# EAGLE design tweeq-Proto_Motor (EAGLE 6.4)
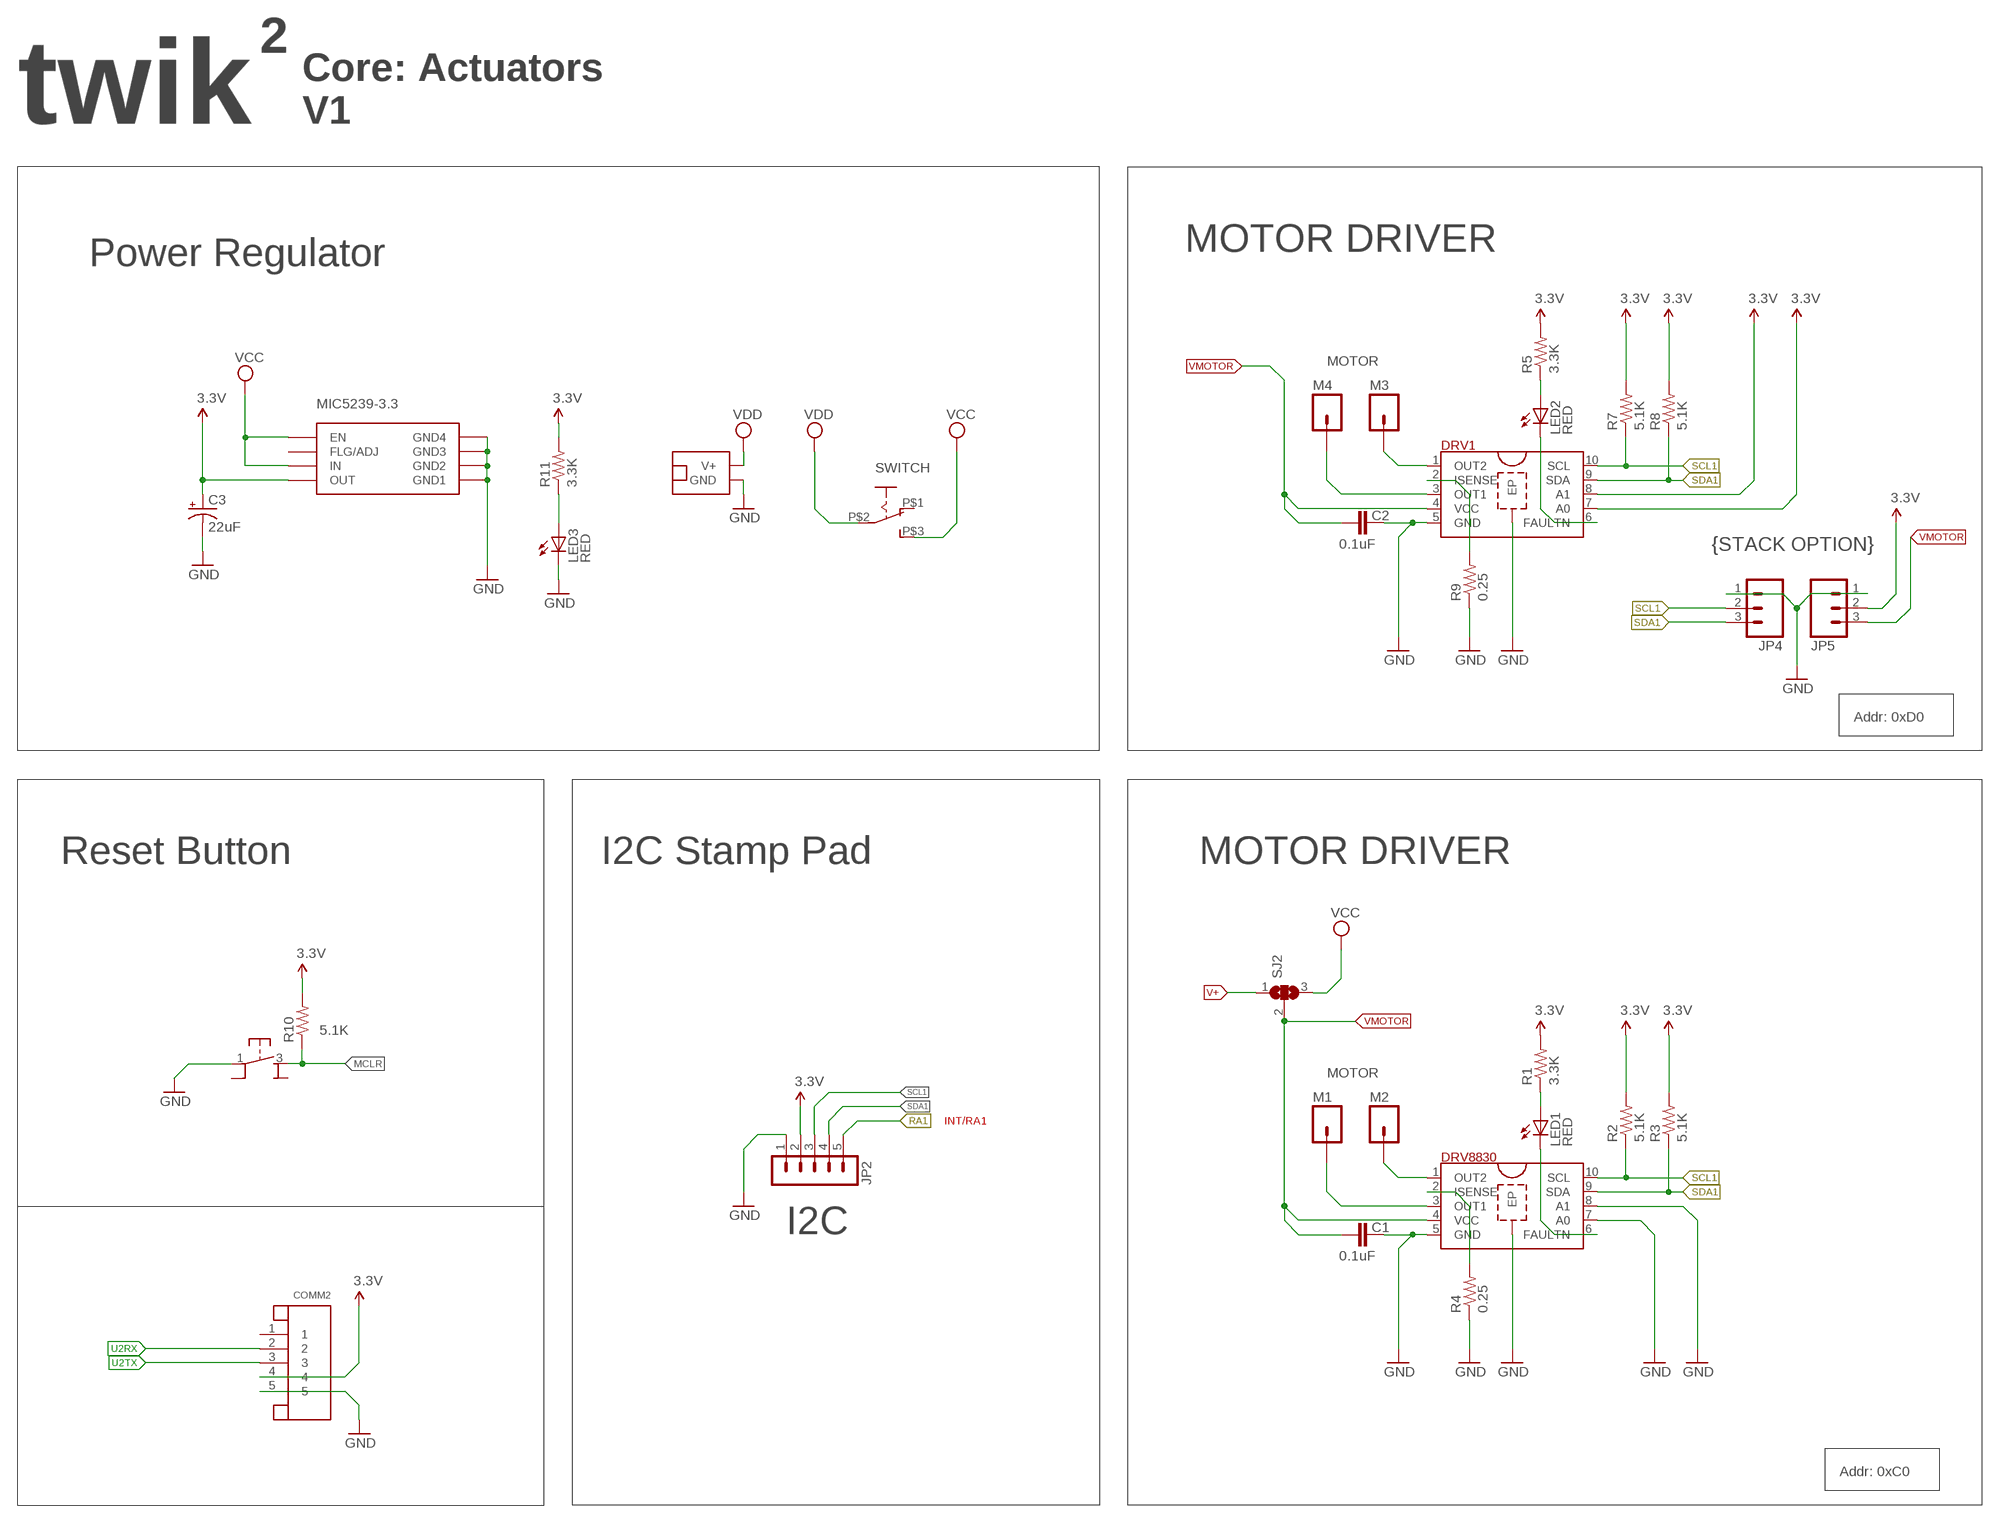
[diagram p0: schematic, sheet 1, part 1 of 2]
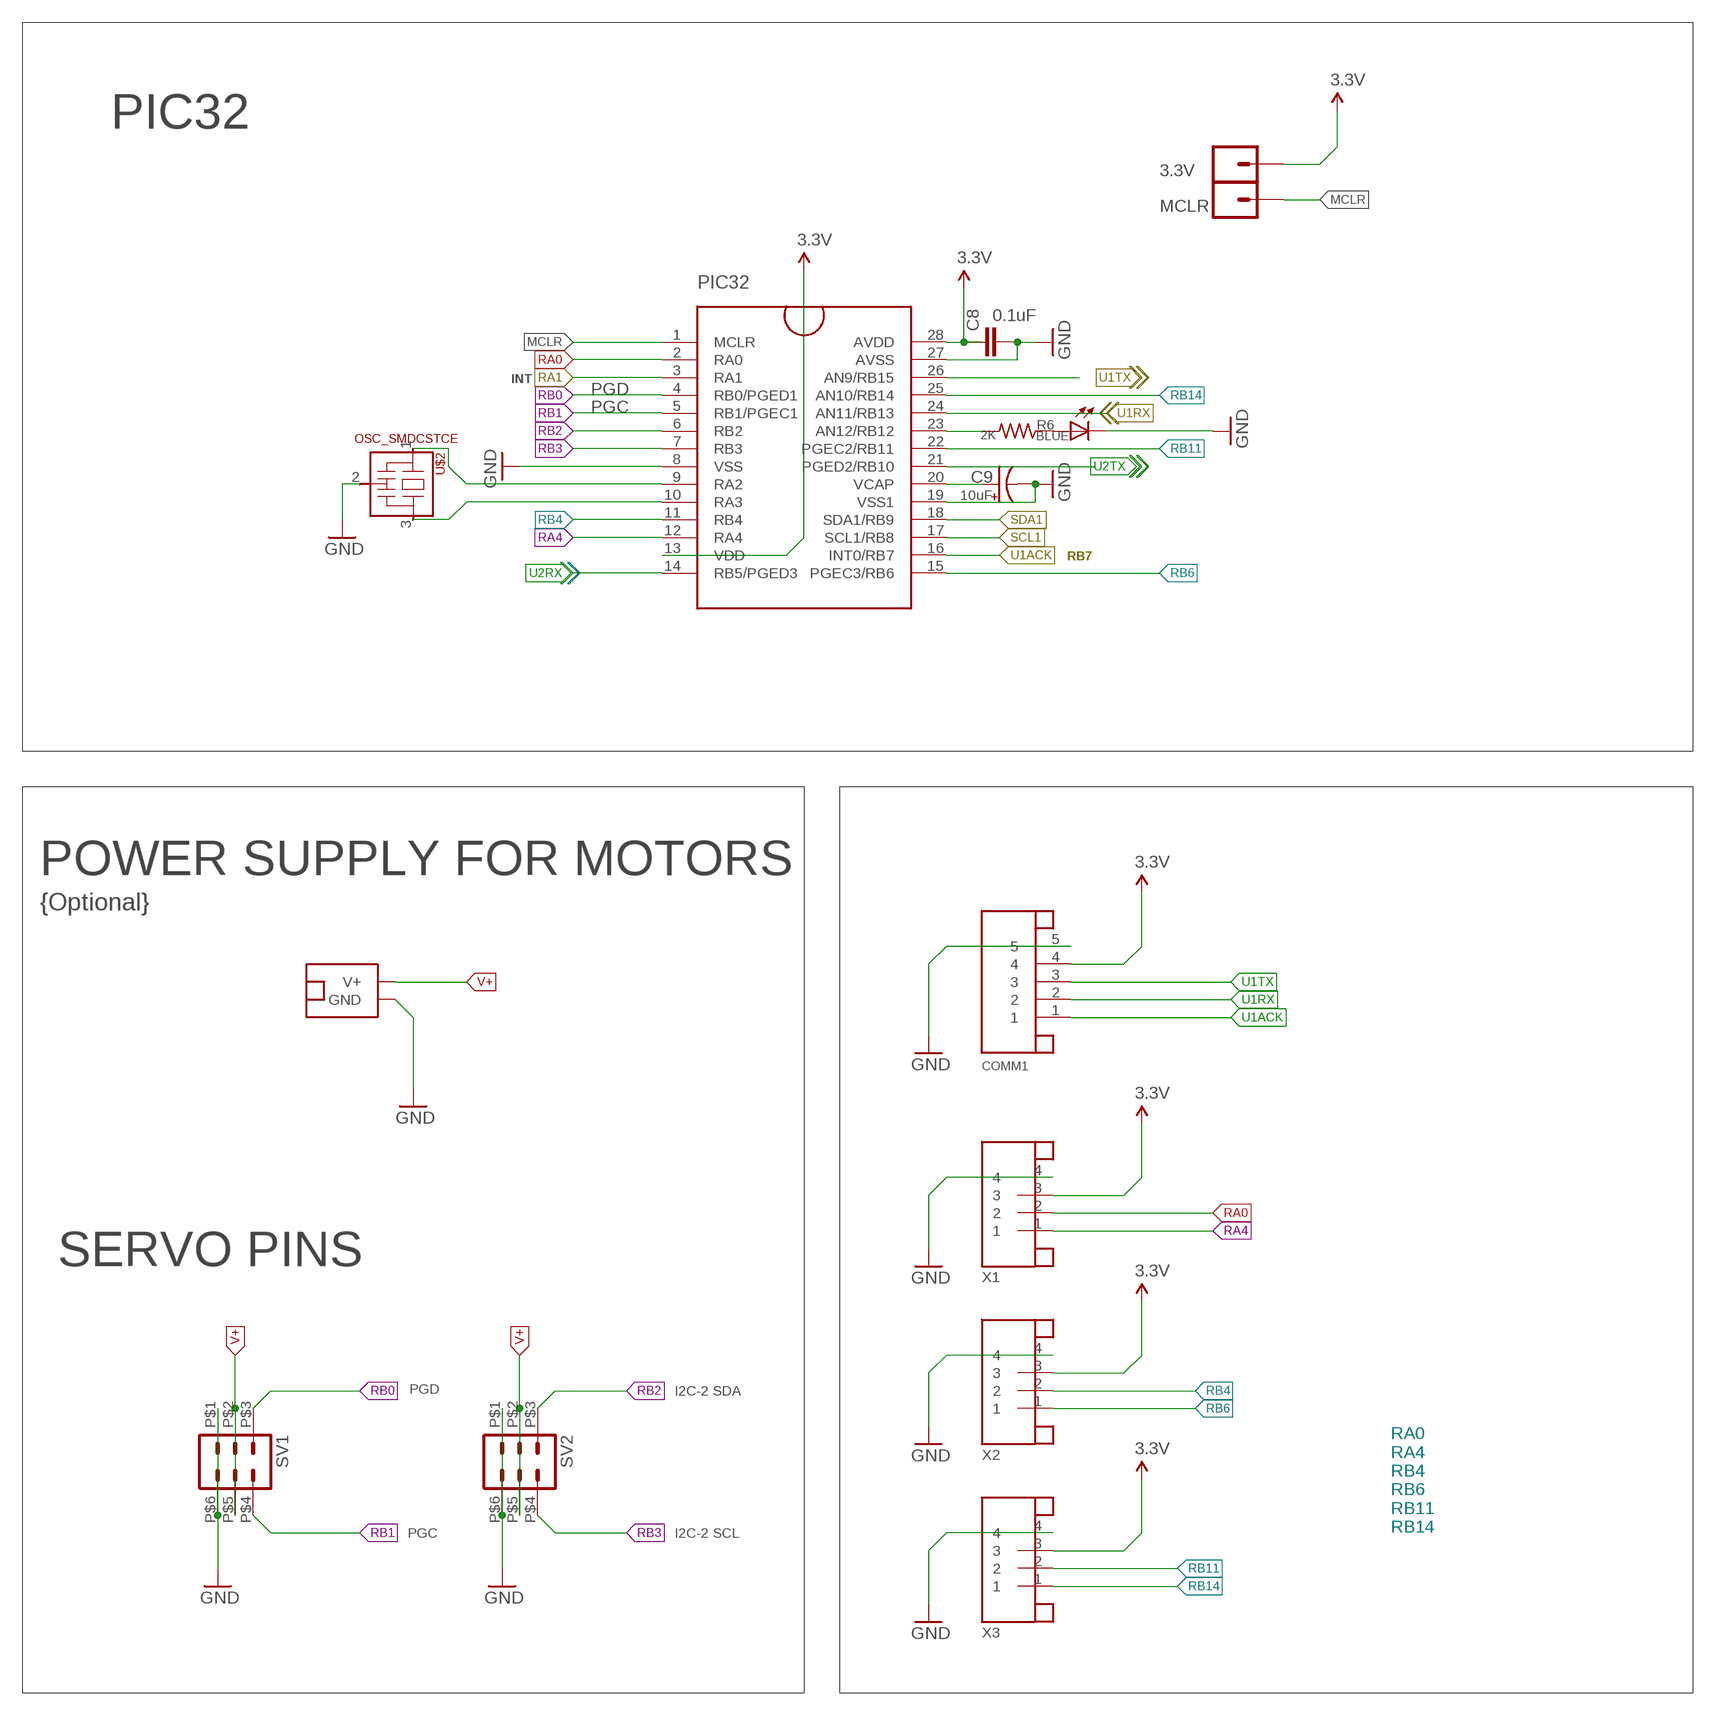
[diagram p1: schematic, sheet 1, part 2 of 2]

## Parts
3.3V  M01  [AISCUBE_1X01_TIGHTFITVIA]
C1  0.1uF  C-EUC0402K  [C0402K]
C2  0.1uF  C-EUC0402K  [C0402K]
C3  22uF  CPOL-USSMCB  [SMC_B]
C8  0.1uF  C-EUC0402K  [C0402K]
C9  10uF  CPOL-USA/3216-18R  [A/3216-18R]
COMM1  JST-5PINSH  [SH1.0-5PIN]
COMM2  JST-5PINSH  [SH1.0-5PIN]
DRV1  DRV8830DGQ  [MSOP10_POWERPAD]
DRV8830  DRV8830DGQ  [MSOP10_POWERPAD]
JP2  M05-11.5MM-SMT  [1X05-1.5MM-SMT]
JP4  M03/NS  [1X03_NS]
JP5  M03/NS  [1X03_NS]
LED1  RED  LEDCHIPLED_0805  [CHIPLED_0805]
LED2  RED  LEDCHIPLED_0805  [CHIPLED_0805]
LED3  RED  LEDCHIP-LED0805  [CHIP-LED0805]
M1  M01SQ_NS  [1X01_SQ]
M2  M01SQ_NS  [1X01_SQ]
M3  M01SQ_NS  [1X01_SQ]
M4  M01SQ_NS  [1X01_SQ]
MCLR  M01  [AISCUBE_1X01_TIGHTFITVIA]
MIC5239-3.3  MIC5239-MM  [MSOP8]
PIC32  PIC32MX_1XX_2XX  [SSOP28]
PIC_LED  BLUE  LEDCHIP-LED0805  [CHIP-LED0805]
R1  3.3K  R-US_R0402  [R0402]
R2  5.1K  R-US_R0402  [R0402]
R3  5.1K  R-US_R0402  [R0402]
R4  0.25  R-US_R0402  [R0402]
R5  3.3K  R-US_R0402  [R0402]
R6  2K  R-US_R0402  [R0402]
R7  5.1K  R-US_R0402  [R0402]
R8  5.1K  R-US_R0402  [R0402]
R9  0.25  R-US_R0402  [R0402]
R10  5.1K  R-US_R0402  [R0402]
R11  3.3K  R-US_R0402  [R0402]
SJ2  JUMPER_SJ2W  [JUMPER_SJ_2]
SV1  M03-2EDGE_PAD  [2X03_EDGEPAD]
SV2  M03-2EDGE_PAD  [2X03_EDGEPAD]
SWITCH  SLIDE_SWITCH_SMALL  [SLIDE_SWITCH_SMALL]
U$2  OSC_SMDCSTCE  [CSTCE_RESONATOR_SMD]
U$4  PB_MICRO_SMT  [PB_SMT_3.5X3X2]
U$9  POWER_CONN/PTH  [POWER_CONN_PTH]
U$10  POWER_CONN/PTH  [POWER_CONN_PTH]
X1  JST-4PINSH  [SH1.0-4PIN]
X2  JST-4PINSH  [SH1.0-4PIN]
X3  JST-4PINSH  [SH1.0-4PIN]

## Nets
3.3V: 3.3V.P$1 C3.+ C8.1 COMM1.4 COMM2.4 DRV1.7(A0) DRV1.8(A1) JP2.2 JP5.2 MIC5239-3.3.4(OUT) PIC32.13(VDD) PIC32.28(AVDD) R1.2 R2.2 R3.2 R5.2 R7.2 R8.2 R10.2 R11.2 X1.3 X2.3 X3.3
GND: C1.2 C2.2 C3.- C8.2 C9.- COMM1.5 COMM2.5 DRV1.5(GND) DRV1.EP DRV8830.5(GND) DRV8830.7(A0) DRV8830.8(A1) DRV8830.EP JP2.1 JP4.1 JP5.1 LED3.C MIC5239-3.3.5(GND1) MIC5239-3.3.6(GND2) MIC5239-3.3.7(GND3) MIC5239-3.3.8(GND4) PIC32.8(VSS) PIC32.19(VSS1) PIC32.27(AVSS) PIC_LED.C R4.1 R9.1 SV1.P$1 SV1.P$6 SV2.P$1 SV2.P$6 U$2.2(VSS) U$4.1 U$9.GND U$10.GND X1.4 X2.4 X3.4
LED: PIC32.23(AN12/RB12) R6.2
MCLR: MCLR.P$1 PIC32.1(MCLR) R10.1 U$4.3
N$2: PIC32.9(RA2) U$2.1
N$3: PIC_LED.A R6.1
N$4: C9.+ PIC32.20(VCAP)
N$6: PIC32.10(RA3) U$2.3
N$8: DRV8830.6(FAULTN) LED1.C
N$9: LED1.A R1.1
N$10: DRV8830.1(OUT2) M2.1
N$11: DRV8830.3(OUT1) M1.1
N$12: DRV8830.2(ISENSE) R4.2
N$15: DRV1.6(FAULTN) LED2.C
N$16: LED2.A R5.1
N$17: DRV1.1(OUT2) M3.1
N$18: DRV1.3(OUT1) M4.1
N$19: DRV1.2(ISENSE) R9.2
N$20: LED3.A R11.1
RA0: PIC32.2(RA0) X1.2
RA1: JP2.5 PIC32.3(RA1)
RA4: PIC32.12(RA4) X1.1
RB0: PIC32.4(RB0/PGED1) SV1.P$3
RB1: PIC32.5(RB1/PGEC1) SV1.P$4
RB2: PIC32.6(RB2) SV2.P$3
RB3: PIC32.7(RB3) SV2.P$4
RB4: PIC32.11(RB4) X2.2
RB6: PIC32.15(PGEC3/RB6) X2.1
RB11: PIC32.22(PGEC2/RB11) X3.2
RB14: PIC32.25(AN10/RB14) X3.1
SCL1: DRV1.10(SCL) DRV8830.10(SCL) JP2.3 JP4.2 PIC32.17(SCL1/RB8) R2.1 R7.1
SDA1: DRV1.9(SDA) DRV8830.9(SDA) JP2.4 JP4.3 PIC32.18(SDA1/RB9) R3.1 R8.1
U1ACK: COMM1.1 PIC32.16(INT0/RB7)
U1RX: COMM1.2 PIC32.24(AN11/RB13)
U1TX: COMM1.3 PIC32.26(AN9/RB15)
U2RX: COMM2.2 PIC32.14(RB5/PGED3)
U2TX: COMM2.3 PIC32.21(PGED2/RB10)
V+: SJ2.1 SV1.P$2 SV1.P$5 SV2.P$2 SV2.P$5 U$10.V+
VCC: MIC5239-3.3.1(EN) MIC5239-3.3.3(IN) SJ2.3 SWITCH.P$3(S)
VDD: SWITCH.P$2(P) U$9.V+
VMOTOR: C1.1 C2.1 DRV1.4(VCC) DRV8830.4(VCC) JP5.3 SJ2.2
Unconnected: COMM2.1 MIC5239-3.3.2(FLG/ADJ) SWITCH.P$1(O) U$4.2(1A) U$4.4(2A)

## Notes on the sheet
- 2
- Core: Actuators
- twik | V1
- MOTOR DRIVER | PIC32
- Power Regulator
- MOTOR
- INT
- PGD
- PGC
- {STACK OPTION}
- I2C-1
- RB7
- Addr: 0xD0
- POWER SUPPLY FOR MOTORS
- Reset Button | I2C Stamp Pad | MOTOR DRIVER
- {Optional}
- MOTOR
- INT/RA1
- I2C-1
- SERVO PINS
- I2C-2
- I2C
- PGD | I2C-2 SDA
- RA0
  RA4
  RB4
  RB6
  RB11
  RB14
- PGC | I2C-2 SCL
- Addr: 0xC0

## Library data of the parts
3.3V M1-M4 MCLR = AISCube:M01: Header 1 Standard 1-pin 0.1" header.
C1 C2 = AISCube:C-EU: CAPACITOR, European symbol
C3 C9 = AISCube:CPOL-US: POLARIZED CAPACITOR, American symbol
C8 = rcl:C-EU: CAPACITOR, European symbol
COMM1 COMM2 = AISCube:JST-5PIN: JST 5 Pin
DRV1 DRV8830 = AISCube:DRV8830
JP2 = AISCube:M05-1: PIN HEADER Standard 0.1" header pin 5 pins - 1 way
JP4 JP5 = AISCube:M03: Header 3 Standard 3-pin 0.1" header
LED1-LED3 PIC_LED = AISCube:LED: LED OSRAM: - CHIPLED LG R971, LG N971, LY N971, LG Q971, LY Q971, LO R971, LY R971 LH N974, LH R974 LS Q976, LO Q976, LY Q976 LO Q996 - Hyper CHIPLED LW Q18S LB Q993, LB Q99A, LB R99A - SideLED LS A670, LO A670, LY A670, LG A670, LP A670 LB A673, LV A673, LT A673, LW A673 LH A674 LY A675 LS A676, LA A676, LO A676, LY A676, LW A676 LS A679, LY A679, LG A679 - Hyper Micro SIDELED® LS Y876, LA Y876, LO Y876, LY Y876 LT Y87S - SmartLED LW L88C, LW L88S LB L89C, LB L89S, LG L890 LS L89K, LO L89K, LY L89K LS L896, LA L896, LO L896, LY L896 - TOPLED LS T670, LO T670, LY T670, LG T670, LP T670 LSG T670, LSP T670, LSY T670, LOP T670, LYG T670 LG T671, LOG T671, LSG T671 LB T673, LV T673, LT T673, LW T673 LH T674 LS T676, LA T676, LO T676, LY T676, LB T676, LH T676, LSB T676, LW T676 LB T67C, LV T67C, LT T67C, LS T67K, LO T67K, LY T67K, LW E67C LS E67B, LA E67B, LO E67B, LY E67B, LB E67C, LV E67C, LT E67C LW T67C LS T679, LY T679, LG T679 LS T770, LO T770, LY T770, LG T770, LP T770 LB T773, LV T773, LT T773, LW T773 LH T774 LS E675, LA E675, LY E675, LS T675 LS T776, LA T776, LO T776, LY T776, LB T776 LHGB T686 LT T68C, LB T68C - Hyper Mini TOPLED® LB M676 - Mini TOPLED Santana® LG M470 LS M47K, LO M47K, LY M47K Source: http://www.osram.convergy.de/
MIC5239-3.3 = AISCube:MIC5239
PIC32 = AISCube:PIC32MX_1XX_2XX: PIC32MX1XX/2XX 32-bit Microcontrollers (up to 128 KB Flash and 32 KB SRAM) with Audio and Graphics Interfaces, USB, and Advanced Analog
R1-R11 = AISCube:R-US_: RESISTOR, American symbol
SJ2 = AISCube:JUMPER_SJ2W: SMD solder JUMPER
SV1 SV2 = AISCube:M03-2: PIN HEADER
SWITCH = AISCube:SLIDE_SWITCH_SMALL: Slide Switch for Main Power Supply
U$2 = AISCube:OSC_SMD: OSC
U$4 = AISCube:PB_MICRO_SMT
U$9 U$10 = AISCube:POWER_CONN: Power Connector
X1-X3 = AISCube:JST-4PIN: JST 4 Pin

## Board
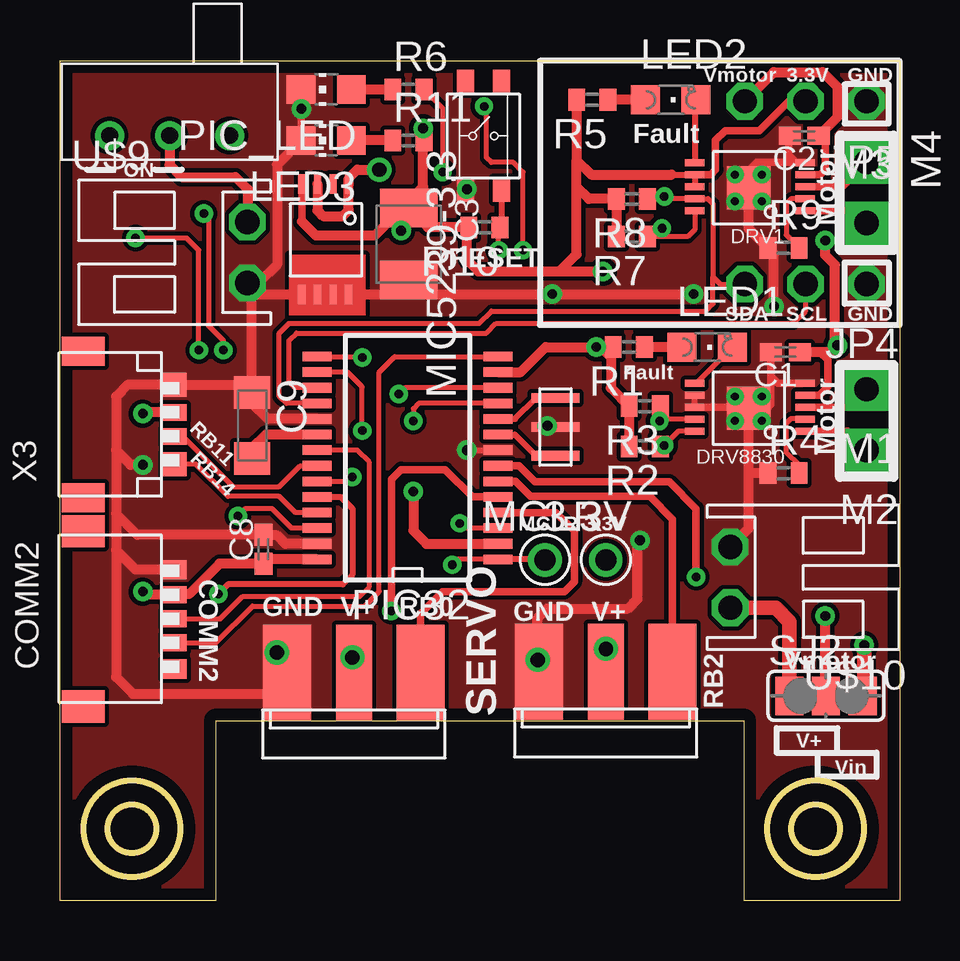
[diagram p2: board, top side]
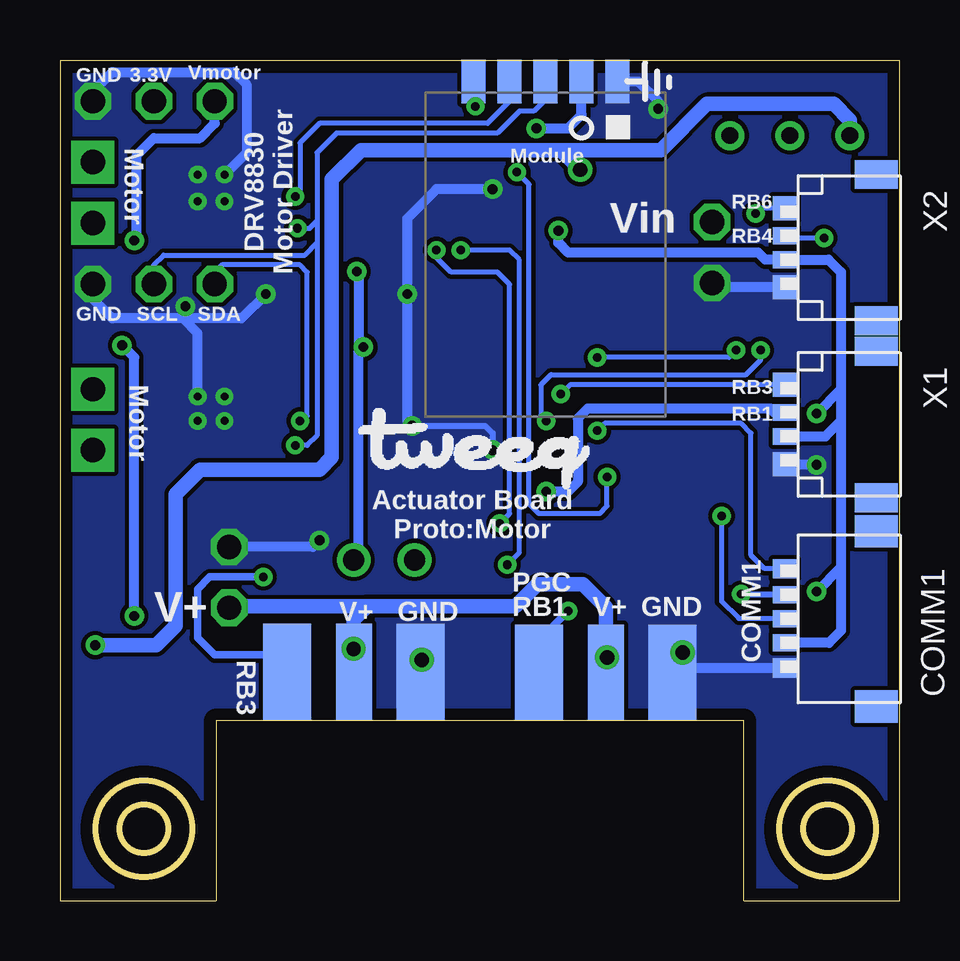
[diagram p3: board, bottom side, seen from below]

Size 35 x 35 mm. Coordinates in mm from the lower left corner, seen from the top.
Outline: 0,35 35,35 35,0 28.5,0 28.5,7.5 6.5,7.5 6.5,0 0,0 0,35
Outline: circle at 3,3 radius 2
Outline: circle at 31.5,3 radius 2
Outline: circle at 3,3 radius 1
Outline: circle at 31.5,3 radius 1
Copper layers (1*16): Top 0.0356mm / dielectric 1.5011mm / Bottom 0.0356mm
Design rules "AISCube": minimum track width 7mil, minimum drill 14mil, track to track 7mil, track to pad 7mil, pad to pad 7mil, via to via 7mil, smd to smd 0mil, copper to edge 20mil, drill to drill 8mil, minimum pad ring 10mil, minimum via ring 8mil, stop-mask expansion 4mil, vias tented up to drill 32mil, thermal gap 10mil
Holes 2 mm at 3,3 31.5,3

### Footprints (pad centres in the part's own frame; a part is rotated, then mirrored left to right if it is on the bottom)
AISCUBE_1X01_TIGHTFITVIA = drill 0.889: P$1 0,0
C0402K = smd 0.925 x 0.74: 1 -0.6,0; 2 0.6,0
SMC_B = smd 1.6 x 2.4: + -1.5,0; - 1.5,0
A/3216-18R = smd 1.35 x 1.5: + 1.375,0; - -1.375,0
SH1.0-5PIN = smd 0.8 x 1: 1 -2.09,-0.55; 5 2.05,-0.55 | smd 0.7 x 1: 2 -1,-0.55; 3 0,-0.55; 4 1,-0.55 | smd 1.35 x 1.8: P$1 -3.65,3.25; P$2 3.65,3.25
MSOP10_POWERPAD = smd 0.8 x 0.3: 1 -2.35,0.95; 2 -2.35,0.45; 3 -2.35,-0.05; 4 -2.35,-0.55; 5 -2.35,-1.05; 6 2.25,-1.05; 7 2.25,-0.55; 8 2.25,-0.05; 9 2.25,0.45; 10 2.25,0.95 | smd 1.8 x 1.8: EP 0,0
1X05-1.5MM-SMT = smd 1 x 1.8: 1 6,0.1; 2 4.5,0.1; 3 3,0.1; 4 1.5,0.1; 5 0,0.1
1X03_NS = drill 1.016 pad 1.524 octagon: 1 0,0; 2 2.54,0; 3 5.08,0
CHIPLED_0805 = smd 1.2 x 1.2: A 0,-1.05; C 0,1.05
CHIP-LED0805 = smd 1.2 x 1.2: A 0,-1.05; C 0,1.05
1X01_SQ = drill 1.016 pad 1.8 square: 1 0,0
MSOP8 = smd 0.8 x 0.3: 1 -2.1,-0.55; 2 -2.1,-1.2; 3 -2.1,-1.85; 4 -2.1,-2.5; 5 2.5,-2.5; 6 2.5,-1.85; 7 2.5,-1.2; 8 2.5,-0.55
SSOP28 = smd 0.4 x 1.2: 1 -4.225,-3.77; 2 -3.575,-3.77; 3 -2.925,-3.77; 4 -2.275,-3.77; 5 -1.625,-3.77; 6 -0.975,-3.77; 7 -0.325,-3.77; 8 0.325,-3.77; 9 0.975,-3.77; 10 1.625,-3.77; 11 2.275,-3.77; 12 2.925,-3.77; 13 3.575,-3.77; 14 4.225,-3.77; 15 4.225,3.77; 16 3.575,3.77; 17 2.925,3.77; 18 2.275,3.77; 19 1.625,3.77; 20 0.975,3.77; 21 0.325,3.77; 22 -0.325,3.77; 23 -0.975,3.77; 24 -1.625,3.77; 25 -2.275,3.77; 26 -2.925,3.77; 27 -3.575,3.77; 28 -4.225,3.77
R0402 = smd 0.7 x 0.9: 1 -0.65,0; 2 0.65,0
JUMPER_SJ_2 = smd 1.168 x 1.6: 1 -1.524,0; 2 0,0; 3 1.524,0
2X03_EDGEPAD = smd 2 x 4: P$1 -2.79,1.54; P$3 2.79,1.54 | smd 1.5 x 4: P$2 0,1.54 | smd 2 x 4 bottom: P$4 2.79,1.54; P$6 -2.79,1.54 | smd 1.5 x 4 bottom: P$5 0,1.54
SLIDE_SWITCH_SMALL = drill 0.7: P$1 2.5,0; P$2 0,0; P$3 -2.5,0
CSTCE_RESONATOR_SMD = smd 0.4 x 2: 1 1.2,0; 2 0,0; 3 -1.2,0
PB_SMT_3.5X3X2 = smd 1 x 0.7: 1 -2.25,0.75; 2 2.25,0.75; 3 -2.25,-0.75; 4 2.25,-0.75
POWER_CONN_PTH = drill 1.016 octagon: GND 2.54,-1.27; V+ 2.54,1.27
SH1.0-4PIN = smd 1 x 1: 1 -1.65,-0.55; 4 1.65,-0.55 | smd 0.7 x 1: 2 -0.5,-0.55; 3 0.5,-0.55 | smd 1.2 x 1.8: P$1 -3.05,3.25; P$2 3.05,3.25

### Placement (x,y rotation side)
3.3V  22.76,14.21 0 top
C1  30.24,22.86 180 top
C2  31.03,31.88 180 top
C3  14.54,27.36 270 top
C8  8.49,14.65 90 top
C9  8.02,19.8 270 top
COMM1  4.22,11.75 270 bottom
COMM2  4.22,11.75 90 top
DRV1  28.71,29.71 180 top
DRV8830  28.71,20.52 180 top
JP2  17.75,34.04 0 bottom
JP4  33.63,25.7 180 top
JP5  33.63,33.32 180 top
LED1  26.98,23.07 270 top
LED2  25.46,33.38 270 top
LED3  11.1,31.68 90 top
M1  33.63,21.32 180 top
M2  33.63,18.78 180 top
M3  33.63,28.24 0 top
M4  33.63,30.78 270 top
MCLR  20.22,14.21 0 top
MIC5239-3.3  12.59,27.77 270 top
PIC32  14.49,18.45 90 top
PIC_LED  11.1,33.81 90 top
R1  23.72,23.07 180 top
R2  24.38,18.94 180 top
R3  24.38,20.61 180 top
R4  30.16,17.82 0 top
R5  22.19,33.38 180 top
R6  14.52,33.81 0 top
R7  23.84,27.68 180 top
R8  23.84,29.25 180 top
R9  30.16,27.21 0 top
R10  17.69,28.07 180 top
R11  14.52,31.68 0 top
SJ2  31.93,8.54 0 top
SV1  12.25,7.96 0 top
SV2  22.75,8 0 top
SWITCH  4.57,31.89 0 top
U$1  [TWEEQ-LOGO-M]  22.56,17.16 0 bottom
U$2  20.65,19.75 270 top
U$4  17.65,31.87 90 top
U$9  5.28,27.02 0 top
U$10  30.49,13.48 180 top
X1  4.22,19.85 270 bottom
X2  4.22,27.22 270 bottom
X3  4.22,19.85 90 top

### Tracks (layer width: path | path; a pad name or v marks a point on that pad's centre or on a via)
3.3V  (via drill 0.41)
  Top 0.254: DRV1.8 DRV1.7 25.5,30.26
  Top 0.305: 10.09,28.3 MIC5239-3.3.4 | JP5.2 30.39,33.32 29.16,32.09 27.74,32.09 27.33,31.68 27.33,30.46 27.13,30.26 DRV1.7
  Top 0.406: C3.+ 14.54,29.16 | 14.54,29.16 15.14,29.75 15.14,31.65 R11.2 15.17,32.16 v15.14,32.19 | 14.54,29.16 13.11,27.72 10.67,27.72 10.09,28.3 | PIC32.28 8.66,14.23 C8.1 6.65,14.05 5.38,12.79 4.81,12.79 COMM2.4 3.59,12.75 v3.45,12.89 | C3.+ 15.34,28.07 R10.2 16.97,27.99 16.97,26.71 17.45,26.23 20.83,26.23 | v14.22,27.93 14.22,28.65 C3.+ | X3.3 3.5,20.35 v3.45,20.3 | PIC32.13 19.2,22.03 20.25,23.07 v22.35,23.07 | v22.35,23.07 22.55,23.07 | 22.55,23.07 R1.2 v22.35,23.07 | 22.55,23.07 22.96,22.67 22.96,21.38 R3.2 R2.2 | R5.2 21.54,30.87 | 21.54,30.87 22.15,30.26 25.5,30.26 | 21.54,29.75 22.04,29.25 R8.2 R7.2 | 21.54,29.75 21.54,30.87 | 21.54,29.75 21.54,26.94 20.83,26.23 | 20.83,26.23 v22.63,26.23
  Bottom 0.406: v14.22,27.93 14.22,27.42 13.82,27.01 5.89,27.01 5.6,26.72 X2.3 2.96,26.72 2.44,26.2 2.44,21.32 | COMM1.4 2.95,10.75 2.44,11.26 2.44,13.9 | 2.44,21.32 2.44,20 | 2.44,20 2.44,13.9 | X1.3 3.09,19.35 2.44,20 | v3.45,20.3 2.44,21.32 | v3.45,12.89 2.44,13.9 | v15.14,32.19 13.82,32.19 13.25,32.76 JP2.2 | 3.3V.P$1 22.55,14.51 22.55,22.87 | 22.55,22.87 v22.35,23.07 | v22.63,26.23 22.55,26.15 22.55,22.87
GND  (via drill 0.33, 0.41, 0.6)
  Top 0.254: U$2.2 20.5,19.8 v20.32,19.8 | v16.97,18.78 PIC32.8 | DRV8830.8 DRV8830.7 | v29.26,21.02 v29.26,20
  Top 0.305: C2.2 30.38,31.83 30.38,31.07 30.69,30.76 DRV1.5 29.06,30.77 28.71,30.42 28.71,30.36 | C1.2 29.64,21.86 | 29.64,21.86 29.92,21.57 DRV8830.5 | DRV8830.8 28.66,20.57 DRV8830.EP 28.73,20.51 29.26,20.51 29.46,20.51 29.64,20.68 29.64,21.86 | LED3.C 10.06,31.7 v10.06,33.01 | DRV1.EP 28.71,30.36 | v29.26,30.26 v28.14,30.26 | v29.26,30.26 v29.26,29.14 v28.14,29.14 | v29.26,30.26 28.81,30.26 28.71,30.36
  Top 0.406: v9.04,10.35 9.46,9.93 SV1.P$6 8.58,8.62 3.05,8.62 2.34,9.33 2.34,14.62 | MIC5239-3.3.5 MIC5239-3.3.6 MIC5239-3.3.7 | MIC5239-3.3.7 MIC5239-3.3.8 13.95,25.27 C3.- 15.12,25.28 v20.52,25.28 v26.42,25.28 | 8,21.5 X3.4 2.82,21.5 2.34,21.02 2.34,18.78 | 8,21.5 C9.- 8.02,20.72 8.66,20.08 PIC32.19 | PIC32.27 9.39,14.88 9.04,15.22 8.51,15.22 C8.2 3.23,15.25 2.34,16.14 | 8,21.5 8,25.56 U$9.GND | COMM2.5 3.15,13.8 2.34,14.62 | v3.45,18.17 2.95,18.17 2.34,18.78 | 2.34,18.78 2.34,16.14 | 2.34,16.14 2.34,14.62 | LED3.C 9.04,30.68 9.04,26.5 8.29,25.75 U$9.GND | PIC_LED.C 10.06,33.8 v10.06,33.01 | U$10.GND 28.71,15.52 28.71,17.77 | 28.71,17.77 DRV8830.EP | R4.1 28.77,17.82 28.71,17.77 | DRV1.EP 28.71,28.02 R9.1 29.77,26.95 v29.77,24.77 | U$4.1 16.93,29.65 v16.97,29.65 | v28.14,20 v28.14,21.02 v29.26,21.02 | v29.26,20 29.26,20.51 | v19.91,10.04 19.91,11.77 20.32,12.18 23.67,12.18 24.08,12.58 24.08,14.92 v24.18,15.02 | MIC5239-3.3.7 8.29,25.27 U$9.GND
  Top 0.61: SV2.P$6 19.96,10 v19.91,10.04
  Bottom 0.254: v20.32,19.8 17.27,19.8 16.97,19.49 v16.97,18.78
  Bottom 0.406: v9.04,10.35 9.04,9.92 SV1.P$6 9.26,9.7 COMM1.5 | X2.4 7.64,25.57 U$9.GND | X1.4 3.48,18.2 v3.45,18.17 | v10.06,33.01 10.06,33.31 10.89,34.14 JP2.1 | v29.26,21.02 29.26,23.66 29.87,24.27 | 29.87,24.27 32.82,24.27 33.63,25.08 JP4.1 | JP5.1 33.63,33.72 32.82,34.53 27.74,34.53 27.23,34.02 27.23,31.18 v28.14,30.26 | 29.87,24.27 29.87,24.67 v29.77,24.77 | v26.42,25.28 27.43,24.27 29.87,24.27 | v16.97,29.65 19.3,29.65 20.52,28.43 v20.52,25.28 20.52,20 v20.32,19.8 | v24.18,15.02 24.45,14.75 U$10.GND
  Bottom 0.61: v19.91,10.04 19.91,9.59 SV2.P$6
  pour Top (no thermals): 0.2,0.19 6.3,0.19 6.3,7.71 28.75,7.71 28.75,0.19 34.75,0.19 34.75,34.73 0.2,34.73
  pour Bottom (no thermals): 0.2,34.73 34.75,34.73 34.75,0.19 28.75,0.19 28.75,7.71 6.3,7.71 6.3,0.19 0.2,0.19
LED  (via drill 0.36)
  Top 0.203: PIC32.23 12.01,17.48 v12.19,17.66 | R6.2 15.95,33.03 v15.95,30.36
  Bottom 0.203: 15.75,30.16 v15.95,30.36 15.44,29.86 15.44,16.55 15.04,16.14 12.5,16.14 12.19,16.44 v12.19,17.66
MCLR  (via drill 0.36)
  Top 0.203: PIC32.1 16.58,14.23 v16.36,14.01 | v18.29,27.11 18.29,28.01 R10.1
  Top 0.254: U$4.3 18.4,28.12 R10.1 | MCLR.P$1 19.59,14.23 PIC32.1
  Bottom 0.203: v18.29,27.11 16.26,27.11 15.85,26.71 15.85,14.51 v16.36,14.01
N$2
  Top 0.254: PIC32.9 18.96,19.43 19.84,18.55 U$2.1
N$3
  Top 0.406: PIC_LED.A R6.1
N$4
  Top 0.406: PIC32.20 8.57,19.43 8.02,18.87 C9.+
N$6
  Top 0.254: PIC32.10 18.98,20.08 19.85,20.95 U$2.3
N$8
  Top 0.203: DRV8830.6 26.53,21.57 LED1.C
N$9
  Top 0.406: LED1.A R1.1
N$10
  Top 0.305: DRV8830.1 32.84,19.57 M2.1
N$11
  Top 0.305: DRV8830.3 32.88,20.57 M1.1
N$12
  Top 0.203: R4.2 30.81,18.14 30.28,18.68 30.28,19.9 30.48,20.1 31.03,20.1 DRV8830.2
N$15
  Top 0.254: LED2.C 26.46,33.33 DRV1.6
N$16
  Top 0.406: LED2.A R5.1
N$17
  Top 0.305: DRV1.1 33.11,28.76 M3.1
N$18
  Top 0.305: DRV1.3 32.61,29.76 M4.1
N$19
  Top 0.203: DRV1.2 30.5,29.26 30.28,29.04 30.28,27.75 R9.2
N$20
  Top 0.406: R11.1 LED3.A
RA0  (via drill 0.41)
  Top 0.406: v14.73,17.05 14.73,15.43 15.28,14.88 PIC32.2
  Bottom 0.406: X1.2 5.23,20.35 5.38,20.51 13.01,20.51 13.41,20.1 13.41,17.46 13.82,17.05 v14.73,17.05
RA1  (via drill 0.36)
  Top 0.203: PIC32.3 16.87,15.53 v16.66,15.73 | v19.3,27.11 19.3,30.36 18.9,30.77 17.98,30.77 17.78,30.97 17.78,33.01 v17.68,33.11
  Bottom 0.203: v16.66,15.73 16.26,16.14 16.26,25.69 16.76,26.2 18.69,26.2 19.3,26.81 v19.3,27.11 | JP2.5 17.75,33.18 v17.68,33.11
RA4  (via drill 0.36)
  Top 0.203: PIC32.12 14.38,21.38 v14.12,21.12
  Bottom 0.203: X1.1 13.74,21.5 v14.12,21.12
RB0
  Top 0.305: PIC32.4 20.69,16.18 21.44,15.43 21.44,13.29 21.03,12.89 15.95,12.89 15.04,11.97 SV1.P$3
  Top 0.406: SV1.P$3
RB1  (via drill 0.36)
  Top 0.203: 18.28,16.85 PIC32.5
  Top 0.305: v13.82,12.07 13.82,17.56 14.22,17.97 16.05,17.97 17.19,16.83 PIC32.5
  Bottom 0.305: SV1.P$4 15.04,11.06 14.84,11.06 v13.82,12.07
RB2
  Top 0.305: PIC32.6 18.98,17.48 19.61,16.85 24.59,16.85 25.54,15.9 SV2.P$3
RB3  (via drill 0.36)
  Top 0.305: PIC32.7 19.14,18.13 19.81,17.46 25.4,17.46 26.52,16.34 v26.52,13.5
  Bottom 0.305: SV2.P$4 26.25,10.25 28.55,10.25 29.26,10.96 29.26,12.99 28.75,13.5 v26.52,13.5
RB4  (via drill 0.36)
  Top 0.203: PIC32.11 14.95,20.73 14.73,20.51 v14.73,20 | v5.79,22.95 5.79,27.11 5.28,27.62 v3.15,27.62
  Bottom 0.203: v5.79,22.95 5.79,22.54 6.4,21.93 14.53,21.93 14.95,21.51 14.95,20.22 v14.73,20 | v3.15,27.62 4.68,27.62 X2.2
RB6  (via drill 0.36)
  Top 0.203: v5.99,28.64 6.2,28.43 6.2,23.96 6.81,23.35 v6.81,22.95 | v12.6,22.64 10.76,22.64 PIC32.15
  Bottom 0.203: X2.1 5.76,28.87 v5.99,28.64 | v6.81,22.95 7.11,22.64 v12.6,22.64
RB11
  Top 0.203: PIC32.22 10.02,18.13 9.14,17.26 7.21,17.26 5.12,19.35 X3.2
RB14
  Top 0.203: PIC32.25 9.81,16.18 9.14,16.85 7.01,16.85 5.66,18.2 X3.1
SCL1  (via drill 0.36)
  Top 0.203: PIC32.17 9.8,21.38 9.55,21.63 9.55,23.35 9.86,23.66 17.78,23.66 18.19,24.06 30.58,24.06 31.09,24.57 JP4.2 | R2.1 25.2,18.96 v25.2,18.98 25.79,19.57 DRV8830.10 | v25.09,28.03 25.09,27.77 25,27.68 R7.1 26.17,27.68 26.46,27.97 DRV1.10
  Bottom 0.203: JP2.3 14.75,33.39 15.24,32.9 15.85,32.9 16.76,31.99 23.47,31.99 24.28,31.18 24.28,28.33 | v25.09,28.03 24.59,28.03 24.28,28.33 | 24.28,28.33 24.28,27.42 | 24.28,27.42 24.28,19.39 24.69,18.98 v25.2,18.98 | JP4.2 31.09,25.79 | 31.09,25.79 31.09,26.5 30.68,26.91 24.79,26.91 24.28,27.42 | JP4.2 31.09,25.79
SDA1  (via drill 0.36)
  Top 0.203: PIC32.18 9.43,20.73 9.14,21.02 9.14,23.66 9.55,24.06 17.48,24.06 17.98,24.57 26.92,24.57 27.23,24.88 27.23,26 | 27.23,26 27.23,29.04 27.01,29.26 DRV1.9 25.28,29.26 | 27.23,26 27.53,25.7 JP4.3 | 25.28,29.26 v25.2,29.35 | DRV8830.9 25.07,20.07 v24.99,20 25.03,20.03 R3.1 | 25.28,29.26 25.27,29.25 R8.1
  Bottom 0.203: JP2.4 16.25,33.31 17.17,32.39 24.18,32.39 24.99,31.58 24.99,29.55 v25.2,29.35 | v24.99,20 24.89,20 24.69,20.2 24.69,26.2 24.99,26.5 28.25,26.5 28.55,26.2 JP4.3
U1ACK  (via drill 0.36)
  Top 0.203: v12.6,19.59 12.6,21.42 11.99,22.03 PIC32.16
  Bottom 0.203: COMM1.1 5.63,13.84 6.2,14.41 6.2,19.49 6.6,19.9 12.29,19.9 v12.6,19.59
U1RX  (via drill 0.36)
  Top 0.254: PIC32.24 11.71,16.83 12.19,16.34 12.19,13.6 11.79,13.19 7.01,13.19 v6.6,12.79
  Bottom 0.254: v6.6,12.79 4.81,12.79 COMM1.2
U1TX  (via drill 0.36)
  Top 0.203: PIC32.26 9.65,15.53 8.84,16.34 7.72,16.34 v7.42,16.04
  Bottom 0.203: v7.42,16.04 7.42,12.48 6.71,11.77 4.79,11.77 COMM1.3
U2RX
  Top 0.203: PIC32.14 13.96,22.68 13.31,22.03 13.31,12.89 12.7,12.28 8.03,12.28 6.5,10.75 COMM2.2
U2TX
  Top 0.203: COMM2.3 6.68,11.75 7.62,12.68 12.5,12.68 12.9,13.09 12.9,18.27 12.39,18.78 PIC32.21
  Top 0.254: PIC32.21
V+  (via drill 0.6)
  Top 0.61: U$10.V+ 29.83,12.21 30.41,11.64 SJ2.1 | v22.76,10.5 SV2.P$5 | SV1.P$5 12.25,10.09 v12.19,10.14
  Bottom 0.406: SV2.P$5 v22.75,10.49 v22.76,10.5
  Bottom 0.61: v12.19,10.14 12.19,9.56 SV1.P$5 12.25,12.23 13.21,13.19 15.09,13.19 16,12.28 22.2,12.28 | 22.2,12.28 22.76,11.72 v22.76,10.5 | U$10.V+ 27.88,12.28 22.2,12.28
VCC  (via drill 0.41, 0.6)
  Top 0.406: MIC5239-3.3.3 10.74,28.77 10.97,28.53 11.79,28.53 12.04,28.78 MIC5239-3.3.1 12.04,30.11 12.39,30.46 v13.31,30.46 | 33.53,8.62 SJ2.3
  Top 0.61: v33.53,10.65 33.53,8.62
  Bottom 0.61: v13.31,30.46 14.12,31.28 | 14.12,31.28 22.45,31.28 23.67,30.06 23.67,18.48 24.18,17.97 29.16,17.97 30.18,16.95 30.18,11.47 30.99,10.65 v33.53,10.65 | SWITCH.P$3 2.07,32.54 2.74,33.21 8.03,33.21 9.96,31.28 14.12,31.28
VDD
  Top 0.406: SWITCH.P$2 4.57,30.67 5.08,30.16 7.32,30.16 7.82,29.65 U$9.V+
VMOTOR  (via drill 0.41)
  Top 0.305: C2.1 31.62,31.86 31.9,31.58 31.9,30.46 31.7,30.26 DRV1.4 | C1.1 31.68,22.86 32,22.54 32,21.42 31.66,21.07 DRV8830.4
  Top 0.406: SJ2.2 31.9,8.58 v31.9,11.87 | C1.1 32.12,22.86 v32.41,23.15 32.31,23.25 32.31,26.5 31.9,26.91 v31.9,27.52 | C2.1 32.41,32.66 32.41,33.92 31.8,34.53 29.76,34.53 JP5.3
  Bottom 0.406: v31.9,11.87 31.9,22.64 v32.41,23.15 | JP5.3 28.55,32.39 29.16,31.79 31.09,31.79 31.8,31.07 31.8,27.62 v31.9,27.52
(copper drawn outside any net)
  shapes: Top area x1

### Text on the board
tPlace: Vmotor | 3.3V | GND | Fault | ON | Motor | RESET | SDA | SCL | GND | Fault | RB11 | Motor | RB14 | MCLR | 3.3V | COMM2 | GND | V+ | RB0 | GND | V+ | Vmotor | SERVO | RB2 | V+ | Vin
bPlace: Vmotor | 3.3V | GND | Motor | DRV8830 / Motor Driver | RB6 | RB4 | Vin | SDA | SCL | GND | RB3 | Motor | RB1 | Actuator Board / Proto:Motor | GND | PGC | V+ | V+ | RB1 | GND | V+ | COMM1 | RB3